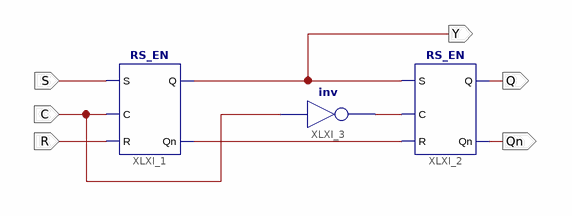
[diagram p0: schematic sheet 1]
// Xilinx ISE schematic RS_Trig.sch (kintex7) as structural Verilog: 3 symbols, 6 ports
module RS_Trig (
  input  C,
  input  S,
  input  R,
  output Y,
  output Q,
  output Qn
);

  wire XLXN_4, XLXN_5;

  RS_EN XLXI_1 (.Q(Y), .Qn(XLXN_4), .C(C), .S(S), .R(R));
  RS_EN XLXI_2 (.Q(Q), .Qn(Qn), .C(XLXN_5), .S(Y), .R(XLXN_4));
  not XLXI_3 (XLXN_5, C);
endmodule
